# Altium schematic sheet DWS.SchDoc
size A3
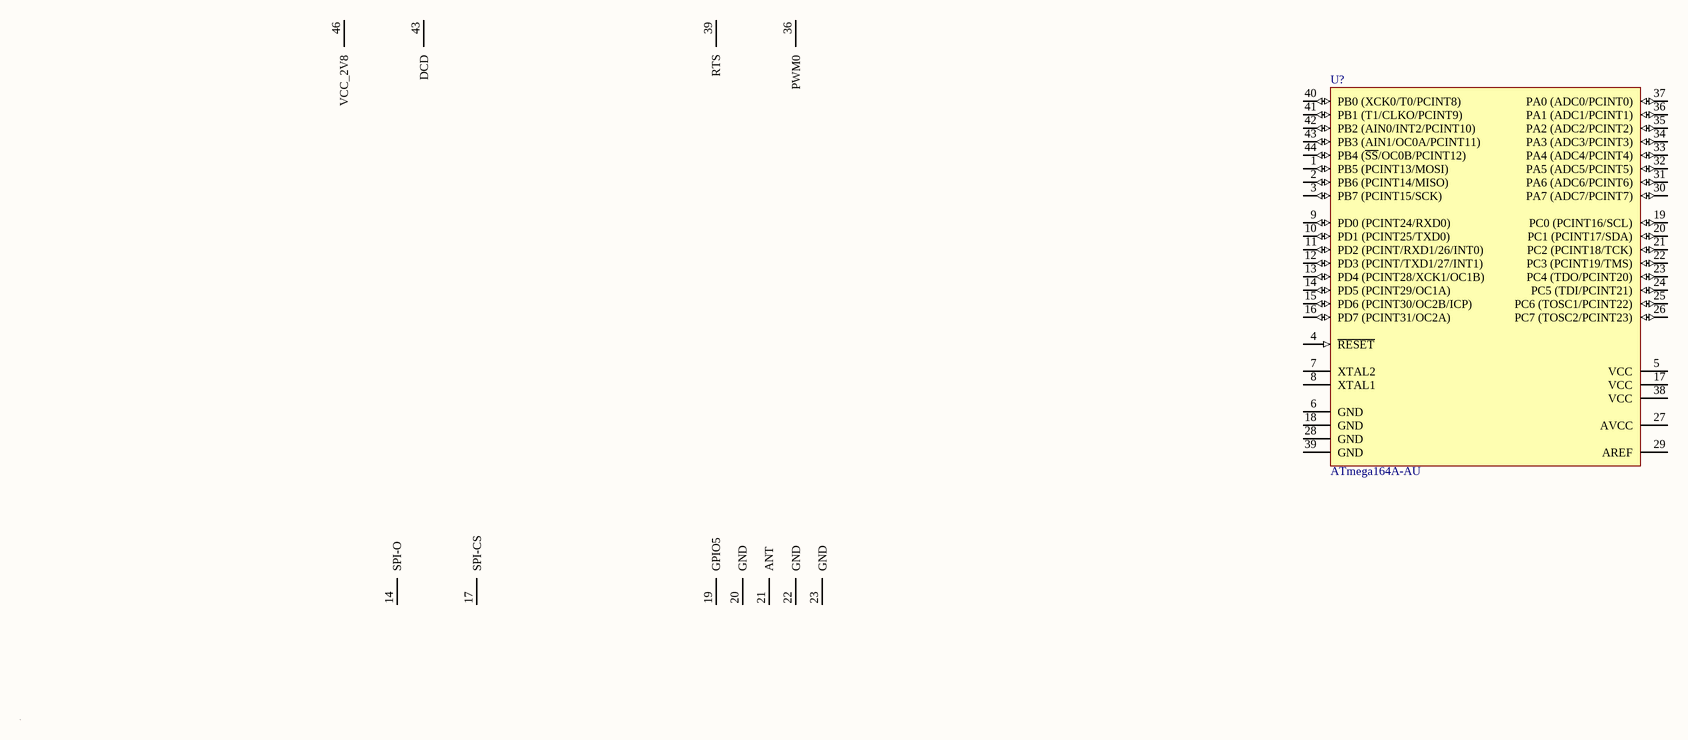
[diagram p0: DWS.SchDoc]

## Parts
?  (no value)
U?  ATmega164A-AU  [44A_M]

## Nets

Not connected (* = marked no-connect by the designer): ? 14(SPI-O) 17(SPI-CS) 19(GPIO5) 20(GND) 21(ANT) 22(GND) 23(GND) 36(PWM0) 39(RTS) 43(DCD) 46(VCC_2V8) ?1; U? 1(PB5_(PCINT13/MOSI)) 2(PB6_(PCINT14/MISO)) 3(PB7_(PCINT15/SCK)) 4(~{RESET}) 5(VCC) 6(GND) 7(XTAL2) 8(XTAL1) 9(PD0_(PCINT24/RXD0)) 10(PD1_(PCINT25/TXD0)) 11(PD2_(PCINT/RXD1/26/INT0)) 12(PD3_(PCINT/TXD1/27/INT1)) 13(PD4_(PCINT28/XCK1/OC1B)) 14(PD5_(PCINT29/OC1A)) 15(PD6_(PCINT30/OC2B/ICP)) 16(PD7_(PCINT31/OC2A)) 17(VCC) 18(GND) 19(PC0_(PCINT16/SCL)) 20(PC1_(PCINT17/SDA)) 21(PC2_(PCINT18/TCK)) 22(PC3_(PCINT19/TMS)) 23(PC4_(TDO/PCINT20)) 24(PC5_(TDI/PCINT21)) 25(PC6_(TOSC1/PCINT22)) 26(PC7_(TOSC2/PCINT23)) 27(AVCC) 28(GND) 29(AREF) 30(PA7_(ADC7/PCINT7)) 31(PA6_(ADC6/PCINT6)) 32(PA5_(ADC5/PCINT5)) 33(PA4_(ADC4/PCINT4)) 34(PA3_(ADC3/PCINT3)) 35(PA2_(ADC2/PCINT2)) 36(PA1_(ADC1/PCINT1)) 37(PA0_(ADC0/PCINT0)) 38(VCC) 39(GND) 40(PB0_(XCK0/T0/PCINT8)) 41(PB1_(T1/CLKO/PCINT9)) 42(PB2_(AIN0/INT2/PCINT10)) 43(PB3_(AIN1/OC0A/PCINT11)) 44(PB4_(~{SS}/OC0B/PCINT12))

## Library data of the parts
? = WISMO 228: Value: *
U? = ATmega164A-AU: 8-bit AVR Microcontroller, 16KB Flash, 512 Bytes EEPROM, 1KB SRAM, 44-pin TQFP, Industrial Grade (-40°C to 85°C); Published: 1-Apr-2010; DatasheetVersion: revA, Jan-2010; PackageVersion: rev.B, Oct-2001; PackageReference: 44A; Publisher: Altium Limited; PackageDescription: 44-Pin Plastic Thin Profile Quad Flat Pack, 10 x 10 x 1.0 mm Body, 0.8 mm Pitch (TQFP); Supplier 1: Digi-Key; Supplier Part Number 1: ATMEGA164A-AU-ND; Supplier 2: Mouser; Supplier Part Number 2: 556-ATMEGA164A-AU; ComponentLink1Description: Manufacturer Link; ComponentLink1URL: http://www.atmel.com/products/avr/default.asp?; ComponentLink2Description: ATmega164A/164PA/324A/324PA/644A/644PA/1284/1284P Datasheet; ComponentLink2URL: http://www.atmel.com/dyn/resources/prod_documents/doc8272.pdf; ComponentLink3Description: ATmega164A/164PA/324A/324PA/644A/644PA/1284/1284P Summary; ComponentLink3URL: http://www.atmel.com/dyn/resources/prod_documents/8272S.pdf; ComponentLink4Description: Atmel.com Home; ComponentLink4URL: http://www.atmel.com